# EAGLE design smartswitch (EAGLE 7.6.0)
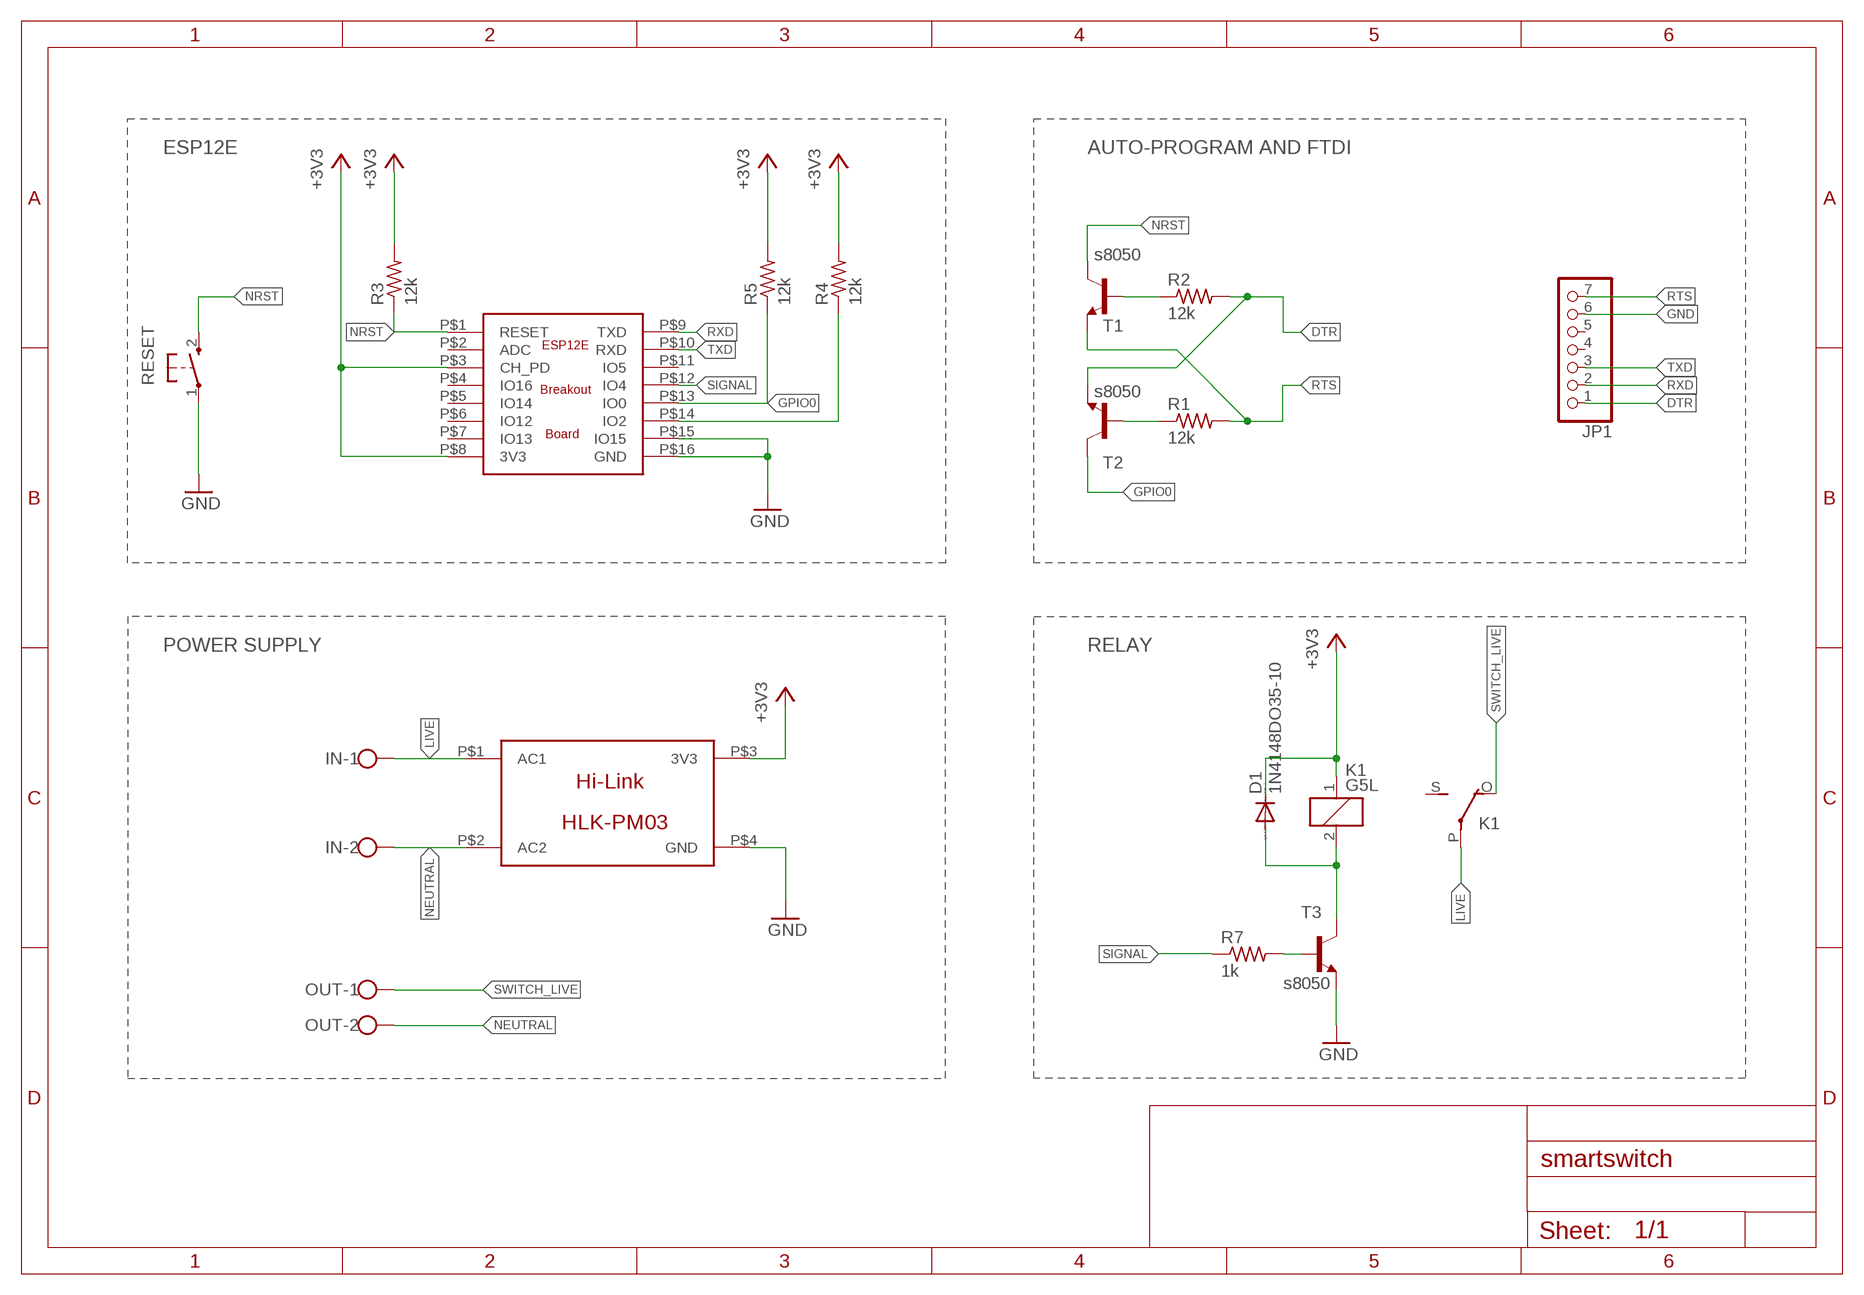
[diagram p0: schematic, sheet 1]

## Parts
D1  1N4148DO35-10  [DO35-10]
IN  W237-102  [W237-102]
JP1  PINHD-1X7  [1X07]
K1  G5L  [G5LE]
OUT  W237-102  [W237-102]
R1  12k  R-US_0309/12  [0309/12]
R2  12k  R-US_0309/12  [0309/12]
R3  12k  R-US_0309/12  [0309/12]
R4  12k  R-US_0309/12  [0309/12]
R5  12k  R-US_0309/12  [0309/12]
R7  1k  R-US_0309/12  [0309/12]
RESET  PB  [PBTH]
T1  s8050  -NPN-TO92-EBC  [TO92-EBC]
T2  s8050  -NPN-TO92-EBC  [TO92-EBC]
T3  s8050  -NPN-TO92-EBC  [TO92-EBC]
U$1  ESP12E_BREAKOUT  [ESP12E]
U$2  HLK-PM03  [HLK-PM03]

## Nets
+3V3: D1.C K1.1 R3.2 R4.2 R5.2 U$1.P$3(CH_PD) U$1.P$8(3V3) U$2.P$3(3V3)
DTR: JP1.1 R2.2 T2.E
GND: JP1.6 RESET.1(P) T3.E U$1.P$15(IO15) U$1.P$16(GND) U$2.P$4(GND)
GPIO0: R5.1 T2.C U$1.P$13(IO0)
LIVE: IN.1 K1.P(2:P) U$2.P$1(AC1)
N$1: R2.1 T1.B
N$2: R1.1 T2.B
N$3: R4.1 U$1.P$14(IO2)
N$4: D1.A K1.2 T3.C
N$6: R7.2 T3.B
NEUTRAL: IN.2 OUT.2 U$2.P$2(AC2)
NRST: R3.1 RESET.2(S) T1.C U$1.P$1(RESET)
RTS: JP1.7 R1.2 T1.E
RXD: JP1.2 U$1.P$9(TXD)
SIGNAL: R7.1 U$1.P$12(IO4)
SWITCH_LIVE: K1.O(2:O) OUT.1
TXD: JP1.3 U$1.P$10(RXD)
Unconnected: JP1.4 JP1.5 K1.S(2:S) U$1.P$2(ADC) U$1.P$4(IO16) U$1.P$5(IO14) U$1.P$6(IO12) U$1.P$7(IO13) U$1.P$11(IO5)

## Notes on the sheet
- ESP12E | AUTO-PROGRAM AND FTDI
- POWER SUPPLY | RELAY

## Library data of the parts
D1 = diode:1N4148: DIODE high speed (Philips)
IN OUT = con-wago-500:W237-102: WAGO SCREW CLAMP; MPN: 237-102; OC_FARNELL: unknown; OC_NEWARK: 70K9898
JP1 = pinhead:PINHD-1X7: PIN HEADER
K1 = relay:G5L: RELAY 1 x switch, 10 A/120 V AC, 8 A/30 V ADC, Omron; OC_FARNELL: unknown; OC_NEWARK: unknown
R1-R5 R7 = rcl:R-US_: RESISTOR, American symbol
RESET = electricalmeter:PB: OMRON SWITCH
T1-T3 = transistor:*-NPN-: NPN Transistror BF959 corrected 2008.03.06
U$1 = ESP12E_breakout:ESP12E_BREAKOUT
U$2 = HLKPM03:HLK-PM03

## Net classes
0 default: width 0.61 mm, drill 0.61 mm, clearance 0.61 mm

## Board
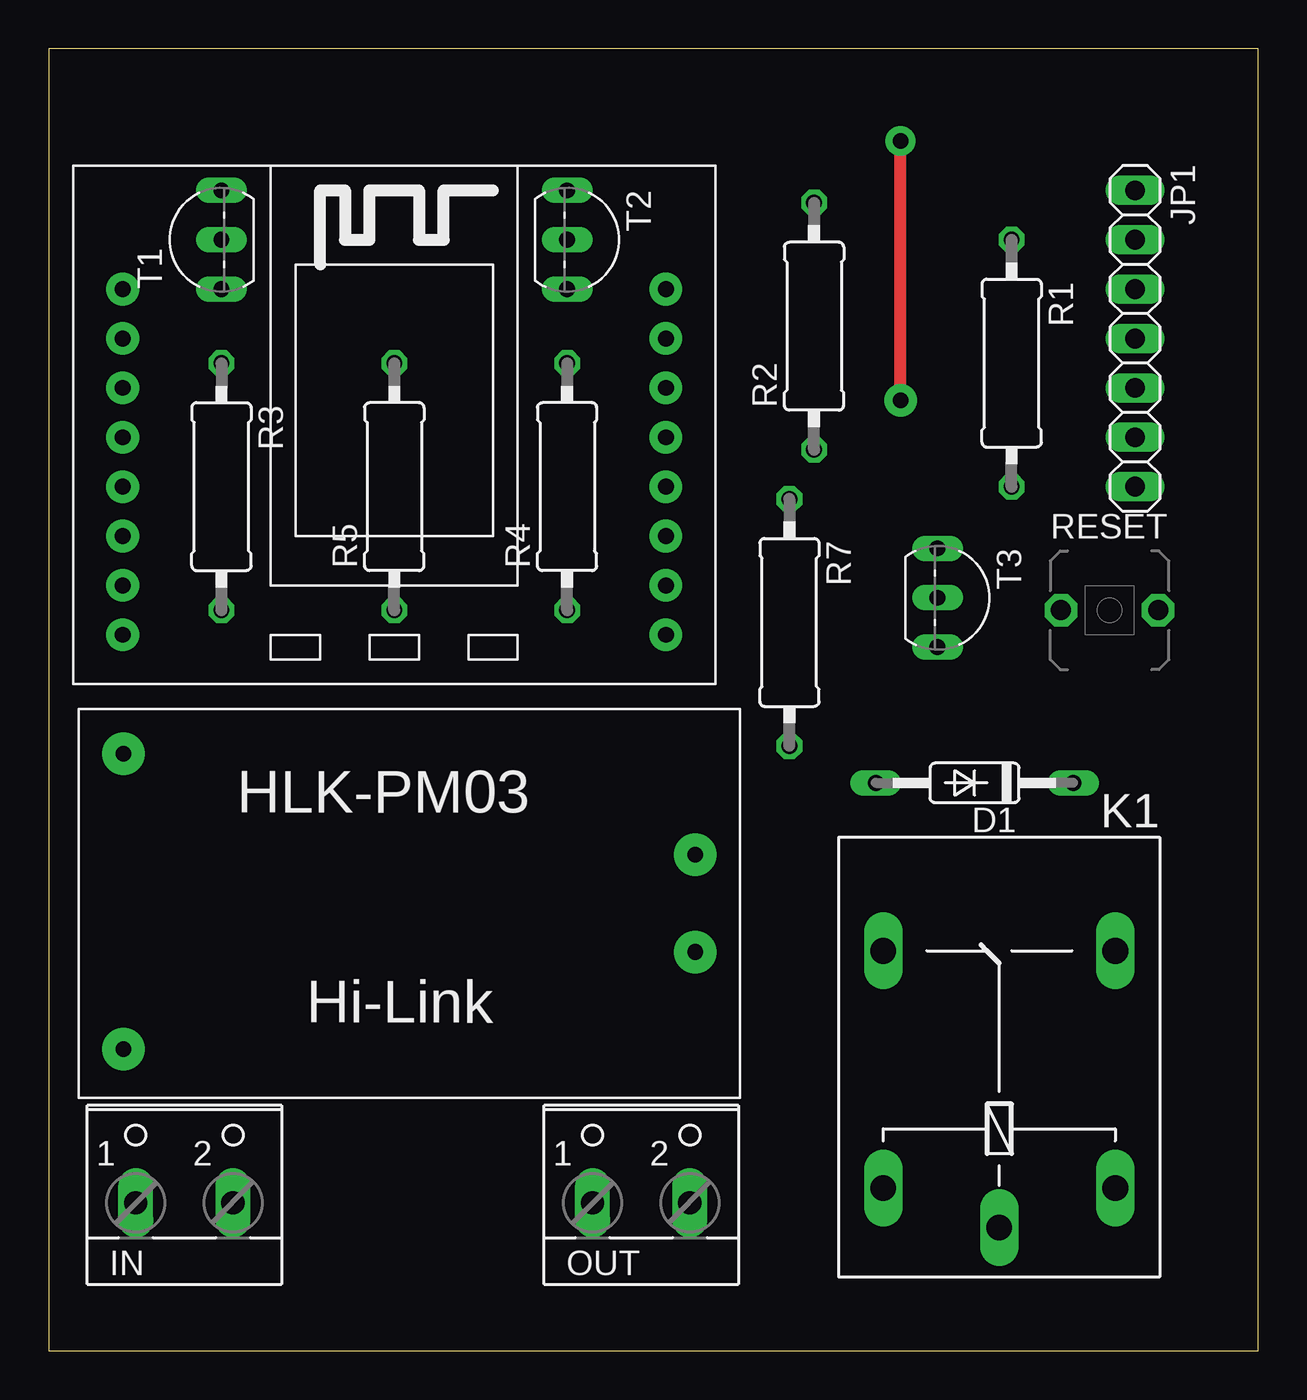
[diagram p1: board, top side]
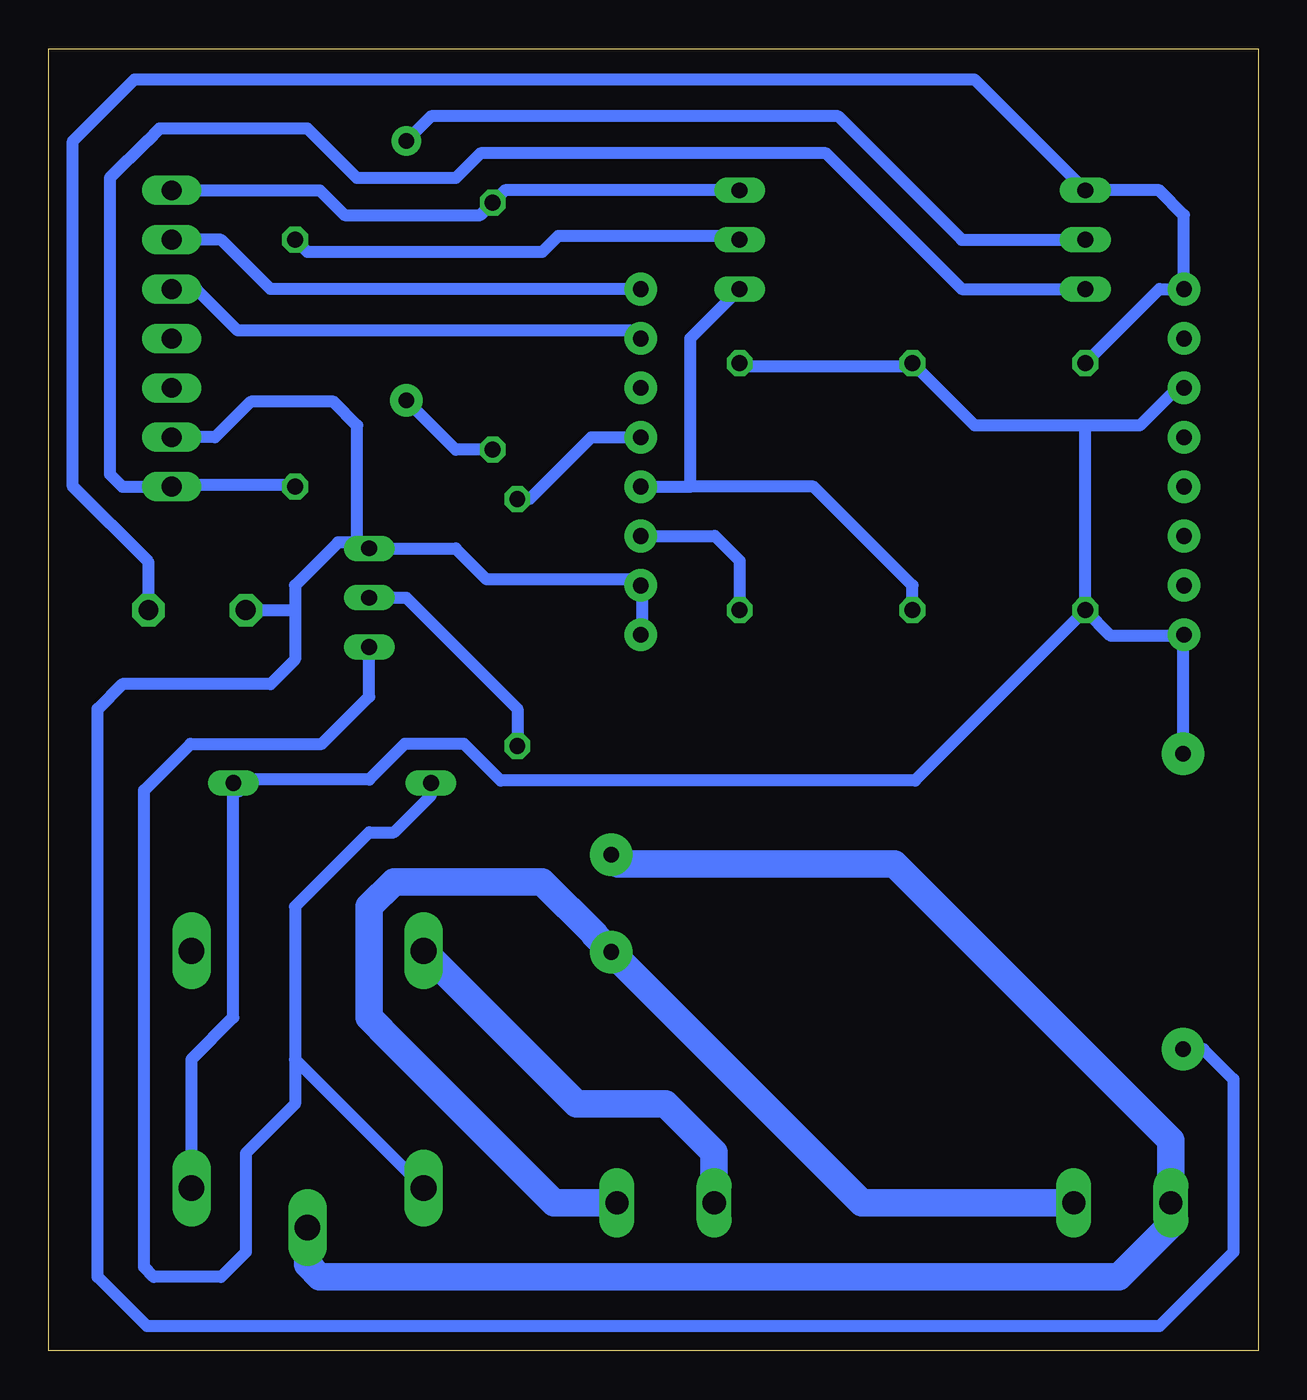
[diagram p2: board, bottom side, seen from below]

Size 62.21 x 66.98 mm. Coordinates in mm from the lower left corner, seen from the top.
Outline: 0,0 62.21,0 62.21,66.98 0,66.98 0,0
Copper layers (1*16): Top 0.035mm / dielectric 1.5mm / Bottom 0.035mm
Design rules "default": minimum track width 10mil, minimum drill 24mil, track to track 8mil, track to pad 8mil, pad to pad 8mil, via to via 8mil, smd to smd 8mil, copper to edge 40mil, drill to drill 8mil, minimum pad ring 10mil, minimum via ring 8mil, stop-mask expansion 4mil, vias tented up to drill 0mil, thermal gap 10mil

### Footprints (pad centres in the part's own frame; a part is rotated, then mirrored left to right if it is on the bottom)
DO35-10 = drill 0.813 long: A 5.08,0; C -5.08,0
W237-102 = drill 1.194 long: 1 -2.5,-1.27; 2 2.5,-1.27
1X07 = drill 1.016 long: 1 -7.62,0; 2 -5.08,0; 3 -2.54,0; 4 0,0; 5 2.54,0; 6 5.08,0; 7 7.62,0
G5LE = drill 1.321 long: 1 -7.493,-5.969; 2 -7.493,5.969; O 4.699,5.969; P -9.525,0; S 4.699,-5.969
0309/12 = drill 0.813 octagon: 1 -6.35,0; 2 6.35,0
PBTH = drill 1.016 pad 1.676 octagon: 1 -0.001,0.001; 2 5.001,0.001
TO92-EBC = drill 0.813 long: B 0,-1.27; C 2.54,-1.27; E -2.54,-1.27
ESP12E = drill 0.813 pad 1.676: P$1 -15.24,7.62; P$2 -15.24,5.08; P$3 -15.24,2.54; P$4 -15.24,0; P$5 -15.24,-2.54; P$6 -15.24,-5.08; P$7 -15.24,-7.62; P$8 -15.24,-10.16; P$9 12.7,7.62; P$10 12.7,5.08; P$11 12.7,2.54; P$12 12.7,0; P$13 12.7,-2.54; P$14 12.7,-5.08; P$15 12.7,-7.62; P$16 12.7,-10.16
HLK-PM03 = drill 0.8 pad 2.184: P$1 -15.48,-2.66; P$2 -15.48,2.34; P$3 13.92,-7.86; P$4 13.92,7.34

### Placement (x,y rotation side)
D1  47.62,29.21 180 top
IN  6.99,8.89 0 top
JP1  55.88,52.07 270 top
K1  48.9,15.87 90 top
OUT  30.48,8.89 0 top
R1  49.53,50.8 270 top
R2  39.37,52.7 90 top
R3  8.89,44.45 270 top
R4  26.67,44.45 90 top
R5  17.78,44.45 90 top
R7  38.1,37.47 270 top
RESET  52.07,38.1 0 top
T1  7.62,57.15 90 top
T2  27.94,57.15 270 top
T3  46.99,38.73 270 top
U$1  19.05,46.99 0 top
U$2  17.78,22.86 180 top

### Tracks (layer width: path | path; a pad name or v marks a point on that pad's centre or on a via)
+3V3
  Bottom 0.61: 52.43,28.78 D1.C | R5.2 18.29,50.65 26.21,50.65 R4.2 | U$1.P$3 4.27,49.43 6.1,47.6 8.89,47.6 | 17.68,50.65 R5.2 | R3.2 17.65,29.34 38.96,29.34 40.84,31.22 43.89,31.22 45.72,29.39 52.43,29.39 D1.C | K1.1 54.86,14.99 52.7,17.14 D1.C | U$2.P$3 3.86,36.78 | 3.86,36.78 U$1.P$8 | 3.86,36.78 7.57,36.78 R3.2 | 8.89,47.6 14.58,47.6 R5.2 | R3.2 8.89,47.6
DTR
  Bottom 0.61: T2.E 38.73,59.69 R2.2 40.01,58.42 46.99,58.42 48.26,59.69 JP1.1
GND
  Bottom 0.61: U$1.P$16 31.7,37.24 31.7,39.06 U$1.P$15 32.31,39.68 39.67,39.68 41.27,41.27 T3.E | 46.33,41.58 45.72,41.58 T3.E | JP1.6 53.65,46.99 51.82,48.82 47.55,48.82 46.33,47.6 46.33,41.58 | 46.33,41.58 T3.E | U$2.P$4 2.82,15.52 1.27,13.97 1.27,5.08 5.08,1.27 57.15,1.27 59.69,3.81 59.69,33.02 58.42,34.29 50.8,34.29 49.53,35.56 49.53,38.1 | 46.33,41.58 47.32,41.58 49.53,39.37 49.53,38.1 | RESET.1 49.53,38.1
GPIO0
  Bottom 0.61: 29.21,44.45 29.21,52.07 T2.C | U$1.P$13 29.21,44.45 | R5.1 17.78,39.37 22.86,44.45 29.21,44.45
LIVE
  Bottom 0.61: 32.92,25.04 U$2.P$1 | IN.1 4.49,6.49
  Bottom 1.422: 32.92,25.04 18.69,25.04 4.49,10.83 IN.1 | K1.P 48.9,4.44 48.26,3.81 7.16,3.81 4.49,6.49
N$1  (via drill 0.8 pad 1.52, 0.8 pad 1.68)
  Top 0.61: v43.81,48.9 v43.81,62.23
  Bottom 0.61: T1.B 15.24,57.15 21.59,63.5 42.55,63.5 v43.81,62.23 43.18,62.86 | R2.1 41.27,46.36 v43.81,48.9
N$2
  Bottom 0.61: T2.B 26.82,57.35 35.99,57.35 36.83,56.52 48.9,56.52 R1.1
N$3
  Bottom 0.61: U$1.P$14 27.94,41.91 26.67,40.64 R4.1
N$4
  Bottom 0.61: 45.72,36.09 T3.C 45.72,33.66 48.16,31.22 54.91,31.22 57.3,28.83 57.3,4.32 56.79,3.81 53.34,3.81 52.07,5.08 52.07,10.16 49.53,12.7 49.53,14.99 | 42.67,28.45 42.67,28.78 D1.A 42.55,28.58 42.67,28.45 | 49.53,14.99 49.53,22.86 45.72,26.67 44.45,26.67 42.67,28.45 | 49.53,14.99 K1.2
N$6
  Bottom 0.61: T3.B 43.81,38.73 38.1,33.02 R7.2
NEUTRAL
  Bottom 0.61: 32.92,20.17 U$2.P$2 | 34.14,21.39 34.14,21.44 | 45.11,16.51 45.11,16.53
  Bottom 1.422: 32.92,20.17 20.37,7.62 IN.2 | 45.11,16.51 36.22,7.62 OUT.2 | 34.14,21.39 33.53,20.78 U$2.P$2 | 34.14,21.44 36.83,24.13 44.45,24.13 45.72,22.86 45.72,17.14 45.11,16.53
NRST
  Bottom 0.61: RESET.2 57.07,40.56 60.96,44.45 60.96,62.23 57.78,65.41 14.61,65.41 T1.C 5.08,59.69 3.81,58.42 U$1.P$1 5.08,54.61 R3.1
RTS
  Bottom 0.61: T1.E 15.24,54.61 22.23,61.59 40.01,61.59 41.27,60.33 46.35,60.33 48.9,62.86 56.52,62.86 57.15,62.23 59.05,60.33 59.05,45.09 58.42,44.45 JP1.7 55.47,44.55 49.63,44.55 R1.2
RXD
  Bottom 0.61: JP1.2 53.34,57.15 50.8,54.61 U$1.P$9
SIGNAL
  Bottom 0.61: 32.31,46.99 U$1.P$12 34.29,46.99 37.47,43.81 R7.1
SWITCH_LIVE
  Bottom 1.422: OUT.1 27.98,10.2 30.48,12.7 35.05,12.7 K1.O
TXD
  Bottom 0.61: JP1.3 54.61,54.61 52.48,52.48 32.31,52.48 31.9,52.07 U$1.P$10